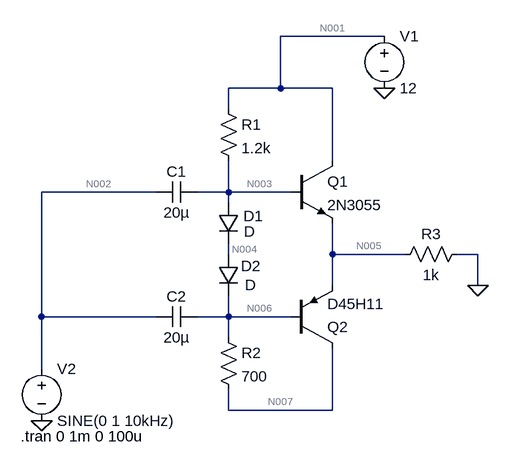
[diagram p0: schematic Class-B.asc]
Class-B.asc, the LTspice schematic file:
Version 4
SHEET 1 880 680
WIRE 288 -128 128 -128
WIRE 128 -48 128 -128
WIRE 128 -48 48 -48
WIRE 208 -48 128 -48
WIRE 48 -16 48 -48
WIRE 208 64 208 -48
WIRE -64 112 -240 112
WIRE 48 112 48 64
WIRE 48 112 0 112
WIRE 144 112 48 112
WIRE 48 128 48 112
WIRE 48 208 48 192
WIRE 208 208 208 160
WIRE 320 208 208 208
WIRE 432 208 400 208
WIRE 208 256 208 208
WIRE 432 256 432 208
WIRE -240 304 -240 112
WIRE -64 304 -240 304
WIRE 48 304 48 272
WIRE 48 304 0 304
WIRE 144 304 48 304
WIRE 48 336 48 304
WIRE -240 384 -240 304
WIRE 48 448 48 416
WIRE 208 448 208 352
WIRE 208 448 48 448
FLAG 432 256 0
FLAG -240 464 0
FLAG 288 -48 0
SYMBOL npn 144 64 R0
SYMATTR InstName Q1
SYMATTR Value 2N3055
SYMBOL pnp 144 352 M180
SYMATTR InstName Q2
SYMATTR Value D45H11
SYMBOL diode 32 128 R0
WINDOW 0 39 21 Left 2
WINDOW 3 40 45 Left 2
SYMATTR InstName D1
SYMBOL diode 32 208 R0
WINDOW 0 35 18 Left 2
WINDOW 3 41 47 Left 2
SYMATTR InstName D2
SYMBOL res 32 -32 R0
SYMATTR InstName R1
SYMATTR Value 1.2k
SYMBOL res 32 320 R0
SYMATTR InstName R2
SYMATTR Value 700
SYMBOL cap 0 96 R90
WINDOW 0 0 32 VBottom 2
WINDOW 3 32 32 VTop 2
SYMATTR InstName C1
SYMATTR Value 20µ
SYMBOL cap 0 288 R90
WINDOW 0 0 32 VBottom 2
WINDOW 3 32 32 VTop 2
SYMATTR InstName C2
SYMATTR Value 20µ
SYMBOL res 416 192 R90
WINDOW 0 0 56 VBottom 2
WINDOW 3 32 56 VTop 2
SYMATTR InstName R3
SYMATTR Value 1k
SYMBOL voltage 288 -144 R0
WINDOW 123 0 0 Left 0
WINDOW 39 0 0 Left 0
SYMATTR InstName V1
SYMATTR Value 12
SYMBOL voltage -240 368 R0
WINDOW 123 0 0 Left 0
WINDOW 39 0 0 Left 0
SYMATTR InstName V2
SYMATTR Value SINE(0 1 10kHz)
TEXT -272 488 Left 2 !.tran 0 1m 0 100u

The netlist it stands for:
* Class-B.asc
Q1 N001 N003 N005 0 2N3055
Q2 N007 N006 N005 0 D45H11
D1 N003 N004 D
D2 N004 N006 D
R1 N001 N003 1.2k
R2 N006 N007 700
C1 N003 N002 20µ
C2 N006 N002 20µ
R3 0 N005 1k
V1 N001 0 12
V2 N002 0 SINE(0 1 10kHz)
.model D D
.lib standard.dio
.model NPN NPN
.model PNP PNP
.lib standard.bjt
.tran 0 1m 0 100u
.backanno
.end

* Results of the author's LTspice run, read from the files saved beside the schematic
* Operating Point, zero values left out:
*   V(n001) = 12 V
*   V(n003) = 11.81 V
*   V(n005) = 11.47 V
*   V(n007) = 11.47 V
*   V(n006) = 11.47 V
*   V(n004) = 11.64 V
*   Ic(Q2) = 6.899 pA
*   Ic(Q1) = 11.32 mA
*   Ib(Q1) = 156.8 µA
*   Ie(Q1) = -11.47 mA
*   I(D2) = 7.087 pA
*   I(D1) = 7.087 pA
*   I(R3) = -11.47 mA
*   I(R2) = 6.898 pA
*   I(R1) = 156.8 µA
*   I(V1) = -11.47 mA
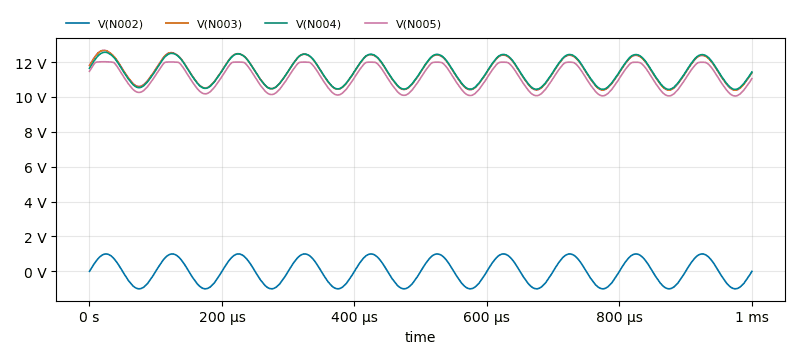
[diagram p1: Transient Analysis of Class-B.asc, plotted from the saved traces]
* Transient Analysis, 1 run:
*   V(N002): min -999.9 mV, max 1 V, average 2.088 mV, rms 711.9 mV, last 0 V
*   V(N003): min 10.39 V, max 12.67 V, average 11.46 V, rms 11.49 V, last 11.39 V
*   V(N004): min 10.44 V, max 12.57 V, average 11.47 V, rms 11.49 V, last 11.43 V
*   V(N005): min 10.06 V, max 12.02 V, average 11.11 V, rms 11.13 V, last 11.05 V